# Altium schematic sheet MOSFET_Sheet.SchDoc
size 420 x 297 mm; SheetNumber: 8; SheetTotal: 9
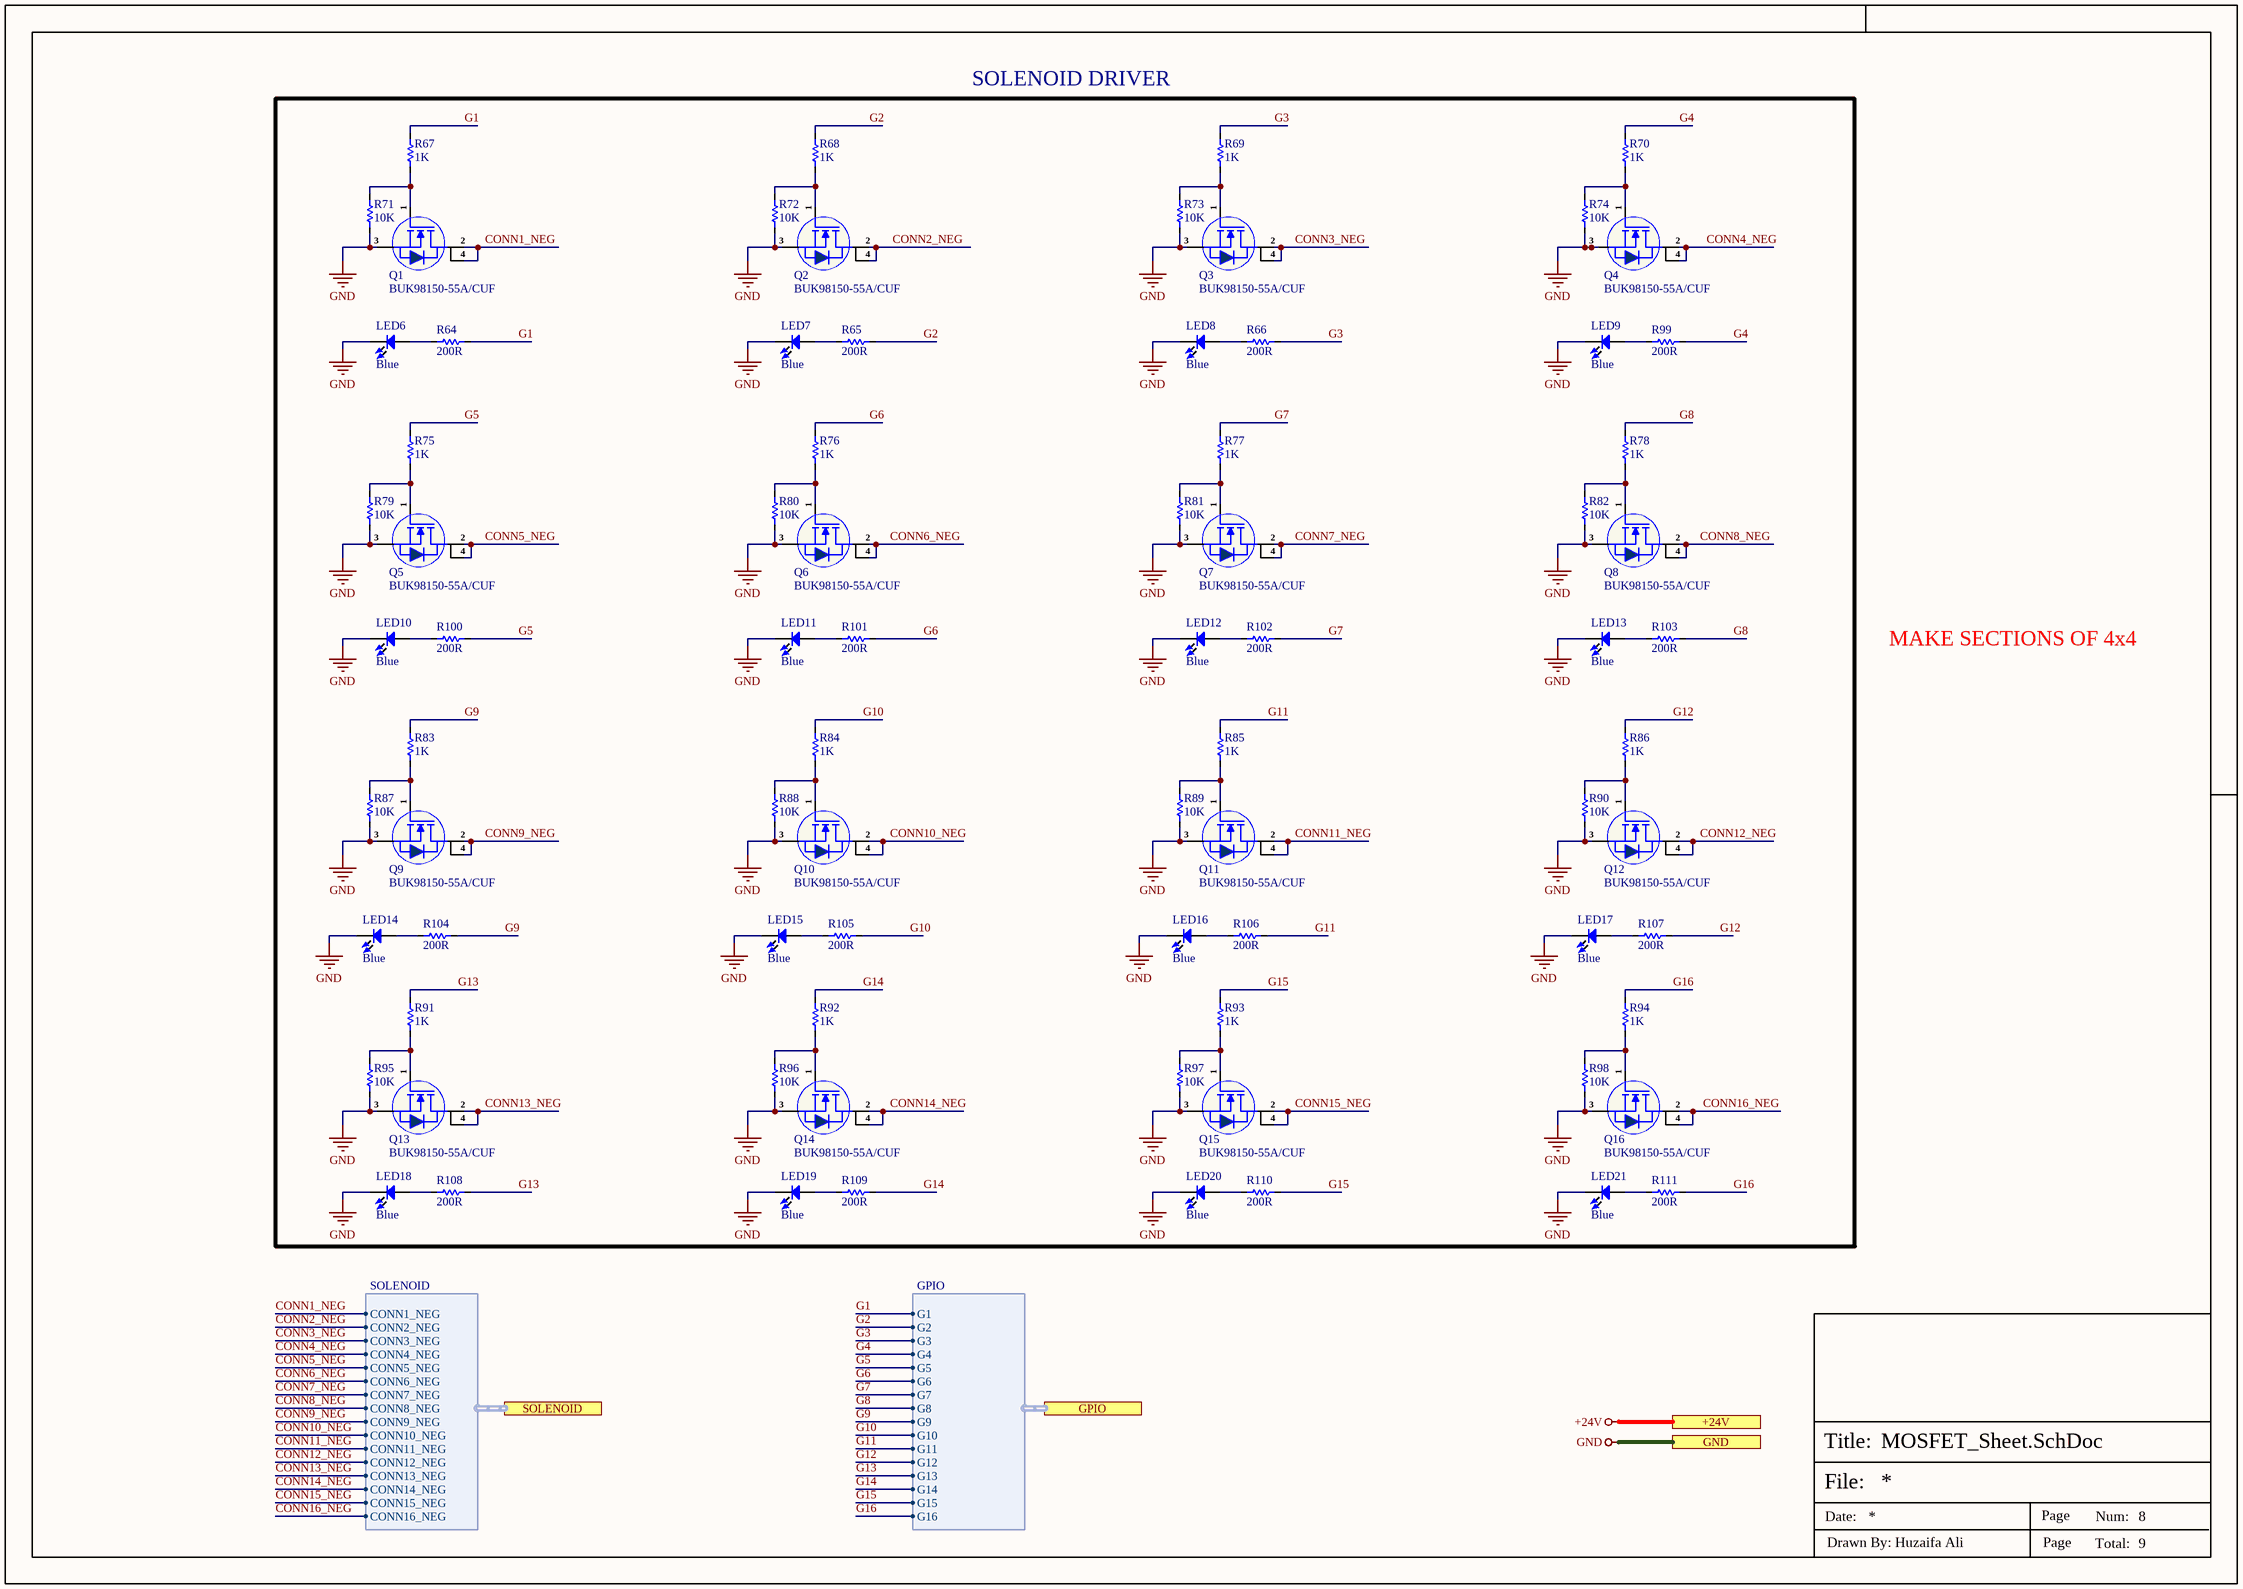
[diagram p0: MOSFET_Sheet.SchDoc]

## Parts
LED6  Blue  [LED-0603]
LED7  Blue  [LED-0603]
LED8  Blue  [LED-0603]
LED9  Blue  [LED-0603]
LED10  Blue  [LED-0603]
LED11  Blue  [LED-0603]
LED12  Blue  [LED-0603]
LED13  Blue  [LED-0603]
LED14  Blue  [LED-0603]
LED15  Blue  [LED-0603]
LED16  Blue  [LED-0603]
LED17  Blue  [LED-0603]
LED18  Blue  [LED-0603]
LED19  Blue  [LED-0603]
LED20  Blue  [LED-0603]
LED21  Blue  [LED-0603]
Q1  BUK98150-55A/CUF  [SOT- 223]
Q2  BUK98150-55A/CUF  [SOT- 223]
Q3  BUK98150-55A/CUF  [SOT- 223]
Q4  BUK98150-55A/CUF  [SOT- 223]
Q5  BUK98150-55A/CUF  [SOT- 223]
Q6  BUK98150-55A/CUF  [SOT- 223]
Q7  BUK98150-55A/CUF  [SOT- 223]
Q8  BUK98150-55A/CUF  [SOT- 223]
Q9  BUK98150-55A/CUF  [SOT- 223]
Q10  BUK98150-55A/CUF  [SOT- 223]
Q11  BUK98150-55A/CUF  [SOT- 223]
Q12  BUK98150-55A/CUF  [SOT- 223]
Q13  BUK98150-55A/CUF  [SOT- 223]
Q14  BUK98150-55A/CUF  [SOT- 223]
Q15  BUK98150-55A/CUF  [SOT- 223]
Q16  BUK98150-55A/CUF  [SOT- 223]
R64  200R  [Res-0402]
R65  200R  [Res-0402]
R66  200R  [Res-0402]
R67  1K  [Res-0402]
R68  1K  [Res-0402]
R69  1K  [Res-0402]
R70  1K  [Res-0402]
R71  10K  [Res-0402]
R72  10K  [Res-0402]
R73  10K  [Res-0402]
R74  10K  [Res-0402]
R75  1K  [Res-0402]
R76  1K  [Res-0402]
R77  1K  [Res-0402]
R78  1K  [Res-0402]
R79  10K  [Res-0402]
R80  10K  [Res-0402]
R81  10K  [Res-0402]
R82  10K  [Res-0402]
R83  1K  [Res-0402]
R84  1K  [Res-0402]
R85  1K  [Res-0402]
R86  1K  [Res-0402]
R87  10K  [Res-0402]
R88  10K  [Res-0402]
R89  10K  [Res-0402]
R90  10K  [Res-0402]
R91  1K  [Res-0402]
R92  1K  [Res-0402]
R93  1K  [Res-0402]
R94  1K  [Res-0402]
R95  10K  [Res-0402]
R96  10K  [Res-0402]
R97  10K  [Res-0402]
R98  10K  [Res-0402]
R99  200R  [Res-0402]
R100  200R  [Res-0402]
R101  200R  [Res-0402]
R102  200R  [Res-0402]
R103  200R  [Res-0402]
R104  200R  [Res-0402]
R105  200R  [Res-0402]
R106  200R  [Res-0402]
R107  200R  [Res-0402]
R108  200R  [Res-0402]
R109  200R  [Res-0402]
R110  200R  [Res-0402]
R111  200R  [Res-0402]

## Ports
+24V (see Top_Sheet[5C], Connector_Sheet[5D], Power_Sheet[5D]), GND (see Top_Sheet[5C], CAN_Sheet[5D], Connector_Sheet[5D], Controller_Sheet[5D], EtherCAT_Sheet[5D], Power_Sheet[5D], RJ45_Sheet[5D], RS485_RS232_Sheet[5D]), GPIO (harness GPIO, see Top_Sheet[5C], Controller_Sheet[4D]), SOLENOID (harness SOLENOID, see Top_Sheet[5C], Connector_Sheet[4D])

## Harnesses
SOLENOID: CONN1_NEG, CONN2_NEG, CONN3_NEG, CONN4_NEG, CONN5_NEG, CONN6_NEG, CONN7_NEG, CONN8_NEG, CONN9_NEG, CONN10_NEG, CONN11_NEG, CONN12_NEG, CONN13_NEG, CONN14_NEG, CONN15_NEG, CONN16_NEG
GPIO: G1, G2, G3, G4, G5, G6, G7, G8, G9, G10, G11, G12, G13, G14, G15, G16

## Nets
+24V: port +24V
GND: LED6.2 LED7.2 LED8.2 LED9.2 LED10.2 LED11.2 LED12.2 LED13.2 LED14.2 LED15.2 LED16.2 LED17.2 LED18.2 LED19.2 LED20.2 LED21.2 Q1.3(S) Q2.3(S) Q3.3(S) Q4.3(S) Q5.3(S) Q6.3(S) Q7.3(S) Q8.3(S) Q9.3(S) Q10.3(S) Q11.3(S) Q12.3(S) Q13.3(S) Q14.3(S) Q15.3(S) Q16.3(S) R71.2 R72.2 R73.2 R74.2 R79.2 R80.2 R81.2 R82.2 R87.2 R88.2 R89.2 R90.2 R95.2 R96.2 R97.2 R98.2 ; port GND
CONN1_NEG: Q1.2(D) Q1.4(D) ; port SOLENOID.CONN1_NEG
CONN2_NEG: Q2.2(D) Q2.4(D) ; port SOLENOID.CONN2_NEG
CONN3_NEG: Q3.2(D) Q3.4(D) ; port SOLENOID.CONN3_NEG
CONN4_NEG: Q4.2(D) Q4.4(D) ; port SOLENOID.CONN4_NEG
CONN5_NEG: Q5.2(D) Q5.4(D) ; port SOLENOID.CONN5_NEG
CONN6_NEG: Q6.2(D) Q6.4(D) ; port SOLENOID.CONN6_NEG
CONN7_NEG: Q7.2(D) Q7.4(D) ; port SOLENOID.CONN7_NEG
CONN8_NEG: Q8.2(D) Q8.4(D) ; port SOLENOID.CONN8_NEG
CONN9_NEG: Q9.2(D) Q9.4(D) ; port SOLENOID.CONN9_NEG
CONN10_NEG: Q10.2(D) Q10.4(D) ; port SOLENOID.CONN10_NEG
CONN11_NEG: Q11.2(D) Q11.4(D) ; port SOLENOID.CONN11_NEG
CONN12_NEG: Q12.2(D) Q12.4(D) ; port SOLENOID.CONN12_NEG
CONN13_NEG: Q13.2(D) Q13.4(D) ; port SOLENOID.CONN13_NEG
CONN14_NEG: Q14.2(D) Q14.4(D) ; port SOLENOID.CONN14_NEG
CONN15_NEG: Q15.2(D) Q15.4(D) ; port SOLENOID.CONN15_NEG
CONN16_NEG: Q16.2(D) Q16.4(D) ; port SOLENOID.CONN16_NEG
G1: R64.2 R67.2 ; port GPIO.G1
G2: R65.2 R68.2 ; port GPIO.G2
G3: R66.2 R69.2 ; port GPIO.G3
G4: R70.2 R99.2 ; port GPIO.G4
G5: R75.2 R100.2 ; port GPIO.G5
G6: R76.2 R101.2 ; port GPIO.G6
G7: R77.2 R102.2 ; port GPIO.G7
G8: R78.2 R103.2 ; port GPIO.G8
G9: R83.2 R104.2 ; port GPIO.G9
G10: R84.2 R105.2 ; port GPIO.G10
G11: R85.2 R106.2 ; port GPIO.G11
G12: R86.2 R107.2 ; port GPIO.G12
G13: R91.2 R108.2 ; port GPIO.G13
G14: R92.2 R109.2 ; port GPIO.G14
G15: R93.2 R110.2 ; port GPIO.G15
G16: R94.2 R111.2 ; port GPIO.G16
NetLED6_1: LED6.1 R64.1
NetLED7_1: LED7.1 R65.1
NetLED8_1: LED8.1 R66.1
NetLED9_1: LED9.1 R99.1
NetLED10_1: LED10.1 R100.1
NetLED11_1: LED11.1 R101.1
NetLED12_1: LED12.1 R102.1
NetLED13_1: LED13.1 R103.1
NetLED14_1: LED14.1 R104.1
NetLED15_1: LED15.1 R105.1
NetLED16_1: LED16.1 R106.1
NetLED17_1: LED17.1 R107.1
NetLED18_1: LED18.1 R108.1
NetLED19_1: LED19.1 R109.1
NetLED20_1: LED20.1 R110.1
NetLED21_1: LED21.1 R111.1
NetQ1_1: Q1.1(G) R67.1 R71.1
NetQ2_1: Q2.1(G) R68.1 R72.1
NetQ3_1: Q3.1(G) R69.1 R73.1
NetQ4_1: Q4.1(G) R70.1 R74.1
NetQ5_1: Q5.1(G) R75.1 R79.1
NetQ6_1: Q6.1(G) R76.1 R80.1
NetQ7_1: Q7.1(G) R77.1 R81.1
NetQ8_1: Q8.1(G) R78.1 R82.1
NetQ9_1: Q9.1(G) R83.1 R87.1
NetQ10_1: Q10.1(G) R84.1 R88.1
NetQ11_1: Q11.1(G) R85.1 R89.1
NetQ12_1: Q12.1(G) R86.1 R90.1
NetQ13_1: Q13.1(G) R91.1 R95.1
NetQ14_1: Q14.1(G) R92.1 R96.1
NetQ15_1: Q15.1(G) R93.1 R97.1
NetQ16_1: Q16.1(G) R94.1 R98.1

## Notes on the sheet
- SOLENOID DRIVER
- MAKE SECTIONS OF 4x4
- File:
- Title:
- Date:
- Page
- Num:
- Total:
- Drawn By: Huzaifa Ali

## Library data of the parts
LED6-LED21 = NCD0603B3: blue 0603 Light Emitting Diodes (LED) ROHS; Manufacturer: Foshan NationStar Optoelectronics; Manufacturer Part Number: NCD0603B3; Package: 0603; LCSC Part Number: C158101; Item Type: LED; ComponentLink1Description: LCSC; ComponentLink1URL: https://www.lcsc.com/product-detail/Light-Emitting-Diodes-LED_Foshan-NationStar-Optoelectronics-NCD0603B3_C158101.html
Q1-Q16 = BUK98150-55A/CUF: MOSFET N-CH 55V 5.5A SOT223; Manufacturer: Nexperia; Max Power Dissipation: 8W; Input Capacitance: 320pF; Rds On Max: 137mR; Turn-Off Delay Time: 16ns; Turn-On Delay Time: 8ns; Rise Time: 57ns; Fall Time: 13ns; Gate to Source Voltage (Vgs): 15V; Supplier: Avnet; LCSC Part Number: C458219; Manufacturer Part Number: BUK98150-55A/CUF; RoHS: Yes; Item Type: MOSFET; Stock: 4000; Pricing: 8000=0.16099, 8100=0.15652, 20000=0.15205, 40000=0.14758, 200000=0.1431, 400000=0.13863 (USD); Case/Package: 73Case; Pins: 4NUMBER; Contact Plating: 154ConductorMaterial; Min Operating Temperature: -55°C; Max Operating Temperature: 150°C; Packaging: 10Packaging; Continuous Drain Current (ID): 5.5A; Drain to Source Voltage (Vdss): 55V; Max Dual Supply Voltage: 55V; Lead Free: 5697LeadFree; ComponentLink1URL: https://datasheet.octopart.com/BUK98150-55A-CUF-Nexperia-datasheet-25360387.pdf?src-supplier=Newark; ComponentLink1Description: https://datasheet.octopart.com/BUK98150-55A-CUF-Nexperia-datasheet-25360387.pdf?src-supplier=Newark; ComponentLink2URL: http://datasheet.octopart.com/BUK98150-55A-CUF-Nexperia-datasheet-87581157.pdf?src-supplier=Mouser; ComponentLink2Description: http://datasheet.octopart.com/BUK98150-55A-CUF-Nexperia-datasheet-87581157.pdf?src-supplier=Mouser; ComponentLink3URL: http://datasheet.octopart.com/BUK98150-55A-CUF-Nexperia-datasheet-87581157.pdf?src-supplier=Rs; ComponentLink3Description: http://datasheet.octopart.com/BUK98150-55A-CUF-Nexperia-datasheet-87581157.pdf?src-supplier=Rs; ComponentLink4URL: http://datasheet.octopart.com/BUK98150-55A-CUF-Nexperia-datasheet-87581157.pdf?src-supplier=Future+Electronics; ComponentLink4Description: http://datasheet.octopart.com/BUK98150-55A-CUF-Nexperia-datasheet-87581157.pdf?src-supplier=Future+Electronics; ComponentLink5URL: http://datasheet.octopart.com/BUK98150-55A-CUF-Nexperia-datasheet-87581157.pdf?src-supplier=TTI; ComponentLink5Description: http://datasheet.octopart.com/BUK98150-55A-CUF-Nexperia-datasheet-87581157.pdf?src-supplier=TTI
R64-R66 R99-R111 = RC0402FR-07200RL: RES 200 OHM 1% 1/16W 0402; Manufacturer: Yageo; Temperature Coefficient: 100ppm/°C; Power Rating: 63mW; Voltage Rating (DC): 50V; Supplier 1: Digi-Key; Manufacturer Part Number: RC0402FR-07200RL; RoHS: Yes; Category: Chip SMD Resistors; Stock 1: 19778; Pricing 1: 1=0.10000, 10=0.01600, 100=0.00660, 1000=0.00299, 2500=0.00259, 5000=0.00214 (USD); Case/Package: 0402; Case Code (Metric): 1005; Case Code (Imperial): 0402; Size Code: 0402; Min Operating Temperature: -55°C; Max Operating Temperature: 155°C; Tolerance: 1%; Resistance: 200R; Resistor Type: Thick Film; Packaging: Tape and Reel; Voltage Rating: 50V; Package Quantity: 1; Number of Terminations: 2; Termination: SMD/SMT; Max Power Dissipation: 63mW; Features: Moisture Resistant; Series: RC; Construction: Rectangular; Resistance Tolerance: 1%; Length: 1mm; Width: 0.02inch; Height: 0.016inch; Depth: 0.5mm; REACH SVHC: No SVHC; Lead Free: Lead Free; RoHS Compliant: Yes; Military Standard: Not; ComponentLink1URL: https://datasheet.ciiva.com/2553/pyu-r-int-thick-7-2553232.pdf?src-supplier=Digi-Key; ComponentLink1Description: https://datasheet.ciiva.com/2553/pyu-r-int-thick-7-2553232.pdf?src-supplier=Digi-Key; ComponentLink2URL: https://datasheet.ciiva.com/7983/1018594-7983509.pdf?src-supplier=Element14; ComponentLink2Description: https://datasheet.ciiva.com/7983/1018594-7983509.pdf?src-supplier=Element14; ComponentLink3URL: https://datasheet.ciiva.com/16804/pyu-rc0402-51-rohs-l-6-r-16804406.pdf?src-supplier=Future+Electronics; ComponentLink3Description: https://datasheet.ciiva.com/16804/pyu-rc0402-51-rohs-l-6-r-16804406.pdf?src-supplier=Future+Electronics; ComponentLink4URL: https://datasheet.ciiva.com/15189/getdatasheetpartid-331152-15189383.pdf?src-supplier=Verical; ComponentLink4Description: https://datasheet.ciiva.com/15189/getdatasheetpartid-331152-15189383.pdf?src-supplier=Verical; ComponentLink5URL: https://datasheet.ciiva.com/7849/1018594-7849898.pdf?src-supplier=Element14; ComponentLink5Description: https://datasheet.ciiva.com/7849/1018594-7849898.pdf?src-supplier=Element14; ComponentLink6URL: https://datasheet.ciiva.com/5562/pyu-rc0402-51-rohs-l-6-r-8721-5562539.pdf?src-supplier=Mouser; ComponentLink6Description: https://datasheet.ciiva.com/5562/pyu-rc0402-51-rohs-l-6-r-8721-5562539.pdf?src-supplier=Mouser; ComponentLink7URL: https://datasheet.ciiva.com/7849/1018594-7849899.pdf?src-supplier=Element14; ComponentLink7Description: https://datasheet.ciiva.com/7849/1018594-7849899.pdf?src-supplier=Element14; ComponentLink8URL: https://datasheet.ciiva.com/2553/pyu-r-int-thick-7-2553230.pdf?src-supplier=Digi-Key; ComponentLink8Description: https://datasheet.ciiva.com/2553/pyu-r-int-thick-7-2553230.pdf?src-supplier=Digi-Key; ComponentLink9URL: https://datasheet.ciiva.com/2553/pyu-r-int-thick-7-2553231.pdf?src-supplier=Digi-Key; ComponentLink9Description: https://datasheet.ciiva.com/2553/pyu-r-int-thick-7-2553231.pdf?src-supplier=Digi-Key; Supplier Part Number 1: 311-200LRCT-ND; LCSC Part Number: C114764
R67-R70 R75-R78 R83-R86 R91-R94 = RC0402FR-071KL: RES 1K OHM 1% 1/16W 0402; Manufacturer: Yageo; Resistance: 1kR; Temperature Coefficient: 100ppm/°C; Voltage Rating (DC): 50V; Power Rating: 62.5mW; Max Power Dissipation: 63mW; Item Type: Resistor; Supplier 1: Avnet; Manufacturer Part Number: RC0402FR-071KL; RoHS: Yes; Category: Chip SMD Resistors; Stock 1: 13030000; Pricing 1: 10000=0.00085, 20000=0.00087, 40000=0.00084, 60000=0.00083, 80000=0.00079, 100000=0.00078, 1000000=0.00076 (USD); Case/Package: 0402; Number of Pins: 2; Case Code (Imperial): 0402; Case Code (Metric): 1005; Size Code: 0402; Min Operating Temperature: -55°C; Max Operating Temperature: 155°C; Resistor Type: Thick Film; Tolerance: 1%; Packaging: Tape and Reel; Voltage Rating: 50V; Termination: SMD/SMT; Features: Moisture Resistant; Series: RC; Number of Terminations: 2; Resistance Tolerance: 1%; Construction: Rectangular; Technology: THICK FILM; Length: 1mm; Width: 0.5mm; Height: 0.32mm; Depth: 0.5mm; Reach SVHC Compliant: Yes; Lead Free: Lead Free; RoHS Compliant: Yes; Military Standard: Not; ComponentLink1URL: https://datasheet.ciiva.com/11819/0900766b80c66297-11819477.pdf?src-supplier=RSComponents; ComponentLink1Description: https://datasheet.ciiva.com/11819/0900766b80c66297-11819477.pdf?src-supplier=RSComponents; ComponentLink2URL: https://datasheet.ciiva.com/7983/1018594-7983502.pdf?src-supplier=Element14; ComponentLink2Description: https://datasheet.ciiva.com/7983/1018594-7983502.pdf?src-supplier=Element14; ComponentLink3URL: https://datasheet.ciiva.com/22747/1018594-22747513.pdf?src-supplier=Element14; ComponentLink3Description: https://datasheet.ciiva.com/22747/1018594-22747513.pdf?src-supplier=Element14; ComponentLink4URL: https://datasheet.ciiva.com/12666/pyu-rc0402-51-rohs-l-6-r-12666741.pdf?src-supplier=Mouser; ComponentLink4Description: https://datasheet.ciiva.com/12666/pyu-rc0402-51-rohs-l-6-r-12666741.pdf?src-supplier=Mouser; ComponentLink5URL: https://datasheet.ciiva.com/7849/1018594-7849869.pdf?src-supplier=Element14; ComponentLink5Description: https://datasheet.ciiva.com/7849/1018594-7849869.pdf?src-supplier=Element14; ComponentLink6URL: https://datasheet.ciiva.com/7849/1018594-7849871.pdf?src-supplier=Element14; ComponentLink6Description: https://datasheet.ciiva.com/7849/1018594-7849871.pdf?src-supplier=Element14; ComponentLink7URL: https://datasheet.ciiva.com/17063/pyu-rc0402-51-rohs-l-6-r-17063193.pdf?src-supplier=Future+Electronics; ComponentLink7Description: https://datasheet.ciiva.com/17063/pyu-rc0402-51-rohs-l-6-r-17063193.pdf?src-supplier=Future+Electronics; Supplier Part Number 1: RC0402FR-071KL; LCSC Part Number: C106235
R71-R74 R79-R82 R87-R90 R95-R98 = RC0402FR-0710KL: RES 10K OHM 1% 1/16W 0402; Manufacturer: Yageo; Resistance: 10kR; Voltage Rating (DC): 50V; Temperature Coefficient: 100ppm/°C; Power Rating: 62.5mW; Max Power Dissipation: 63mW; Item Type: Resistor; Supplier 1: Mouser; Manufacturer Part Number: RC0402FR-0710KL; RoHS: Yes; Category: Chip SMD Resistors; Stock 1: 18648329; Pricing 1: 1=0.10000, 10=0.01400, 50=0.01400, 100=0.00500, 1000=0.00300, 10000=0.00200 (USD); Case/Package: 0402; Number of Pins: 2; Case Code (Imperial): 0402; Case Code (Metric): 1005; Min Operating Temperature: -55°C; Max Operating Temperature: 155°C; Resistor Type: Thick Film; Tolerance: 1%; Packaging: Tape and Reel; Voltage Rating: 50V; Termination: SMD/SMT; Working Voltage: 50V; Number of Terminations: 2; Features: Moisture Resistant; Series: RC; Resistance Tolerance: 1%; Construction: Rectangular; Length: 1mm; Width: 0.5mm; Height: 0.32mm; Depth: 0.5mm; Lead Pitch: 0.2mm; REACH SVHC: No SVHC; Lead Free: Lead Free; RoHS Compliant: Yes; Military Standard: Not; ComponentLink1URL: https://datasheet.ciiva.com/7660/38568-7660787.pdf?src-supplier=Element14; ComponentLink1Description: https://datasheet.ciiva.com/7660/38568-7660787.pdf?src-supplier=Element14; ComponentLink2URL: https://datasheet.ciiva.com/7849/1686128-7849814.pdf?src-supplier=Element14; ComponentLink2Description: https://datasheet.ciiva.com/7849/1686128-7849814.pdf?src-supplier=Element14; ComponentLink3URL: https://datasheet.ciiva.com/7983/1018594-7983486.pdf?src-supplier=Element14; ComponentLink3Description: https://datasheet.ciiva.com/7983/1018594-7983486.pdf?src-supplier=Element14; ComponentLink4URL: https://datasheet.ciiva.com/22747/1018594-22747512.pdf?src-supplier=Element14; ComponentLink4Description: https://datasheet.ciiva.com/22747/1018594-22747512.pdf?src-supplier=Element14; ComponentLink5URL: https://datasheet.ciiva.com/12667/pyu-rc0402-51-rohs-l-6-r-12667067.pdf?src-supplier=Mouser; ComponentLink5Description: https://datasheet.ciiva.com/12667/pyu-rc0402-51-rohs-l-6-r-12667067.pdf?src-supplier=Mouser; ComponentLink6URL: https://datasheet.ciiva.com/7849/1784430-7849813.pdf?src-supplier=Element14; ComponentLink6Description: https://datasheet.ciiva.com/7849/1784430-7849813.pdf?src-supplier=Element14; ComponentLink7URL: https://datasheet.ciiva.com/7849/1784430-7849815.pdf?src-supplier=Element14; ComponentLink7Description: https://datasheet.ciiva.com/7849/1784430-7849815.pdf?src-supplier=Element14; Supplier Part Number 1: 603-RC0402FR-0710KL; LCSC Part Number: C60490